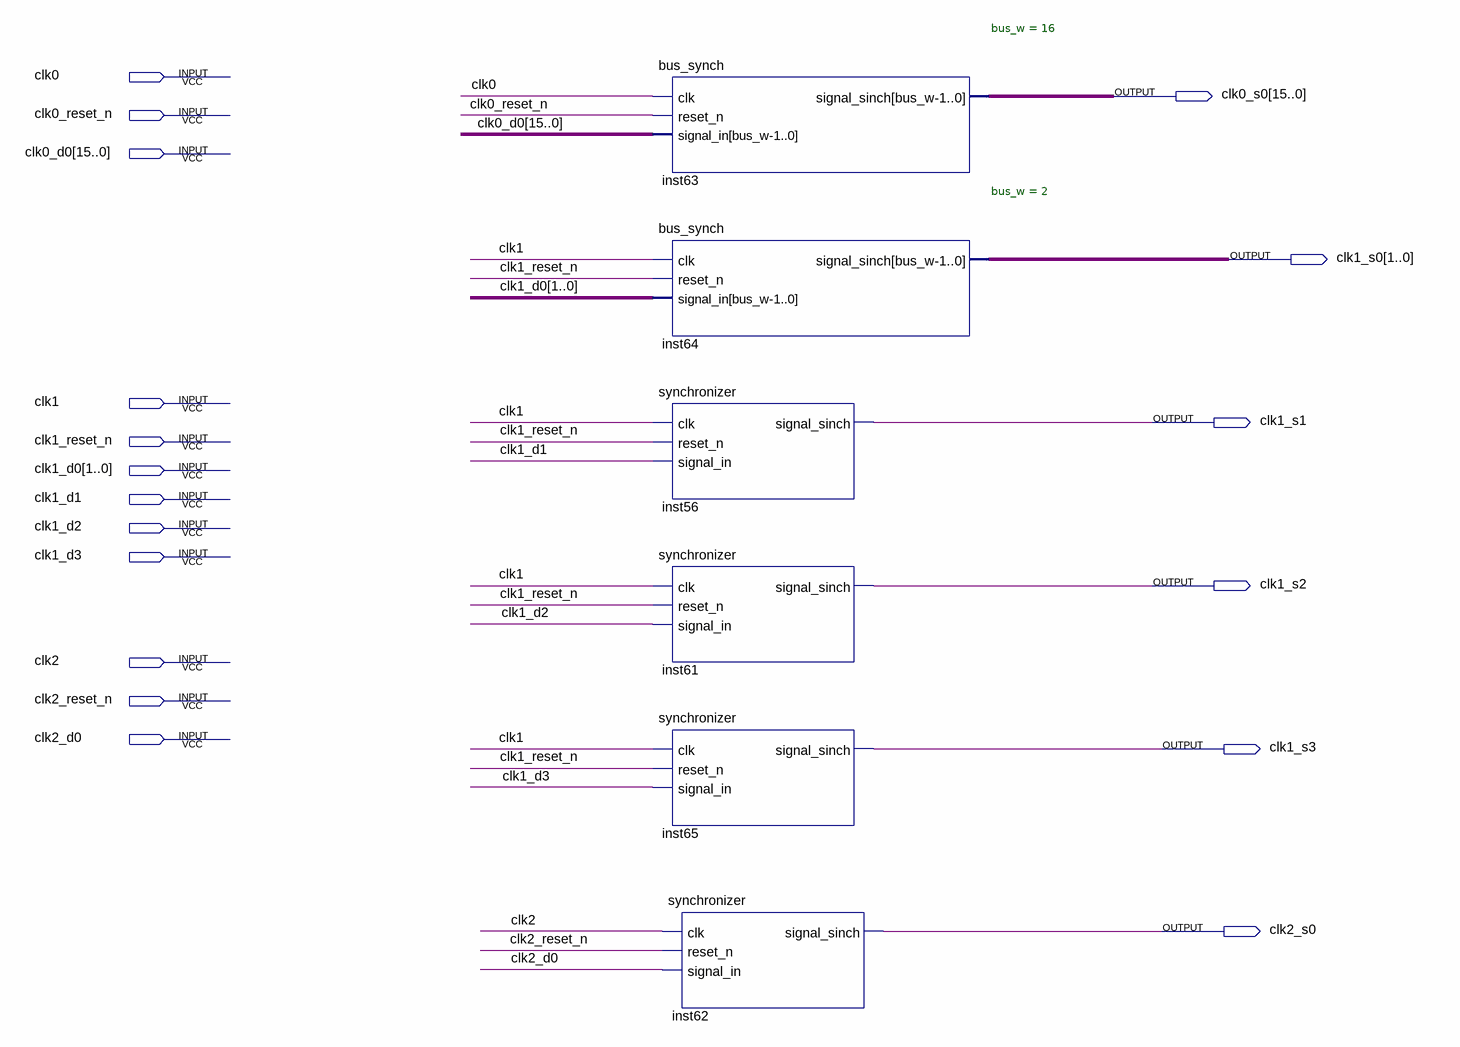
[diagram p0: schematic sheet]
// Quartus schematic tx_synchronizers.bdf as structural Verilog: 6 symbols, 18 pins
module tx_synchronizers (
  input  clk0,
  input  clk0_reset_n,
  input  [15:0] clk0_d0,
  input  clk1,
  input  clk1_reset_n,
  input  [1:0] clk1_d0,
  input  clk1_d1,
  input  clk1_d2,
  input  clk1_d3,
  input  clk2,
  input  clk2_reset_n,
  input  clk2_d0,
  output [15:0] clk0_s0,
  output [1:0] clk1_s0,
  output clk1_s1,
  output clk1_s2,
  output clk1_s3,
  output clk2_s0
);

  bus_synch #(.bus_w(16)) inst63 (.clk(clk0), .reset_n(clk0_reset_n), .signal_in(clk0_d0), .signal_sinch(clk0_s0));
  bus_synch #(.bus_w(2)) inst64 (.clk(clk1), .reset_n(clk1_reset_n), .signal_in(clk1_d0), .signal_sinch(clk1_s0));
  synchronizer inst56 (.clk(clk1), .reset_n(clk1_reset_n), .signal_in(clk1_d1), .signal_sinch(clk1_s1));
  synchronizer inst61 (.clk(clk1), .reset_n(clk1_reset_n), .signal_in(clk1_d2), .signal_sinch(clk1_s2));
  synchronizer inst65 (.clk(clk1), .reset_n(clk1_reset_n), .signal_in(clk1_d3), .signal_sinch(clk1_s3));
  synchronizer inst62 (.clk(clk2), .reset_n(clk2_reset_n), .signal_in(clk2_d0), .signal_sinch(clk2_s0));
endmodule
